# Altium schematic sheet SDRAM_PLEIADES.SchDoc
size Tabloid; DocumentNumber: 1; SheetNumber: 1; SheetTotal: 3; Sheet_Name: PLEIADES MAIN; Size: 11x17
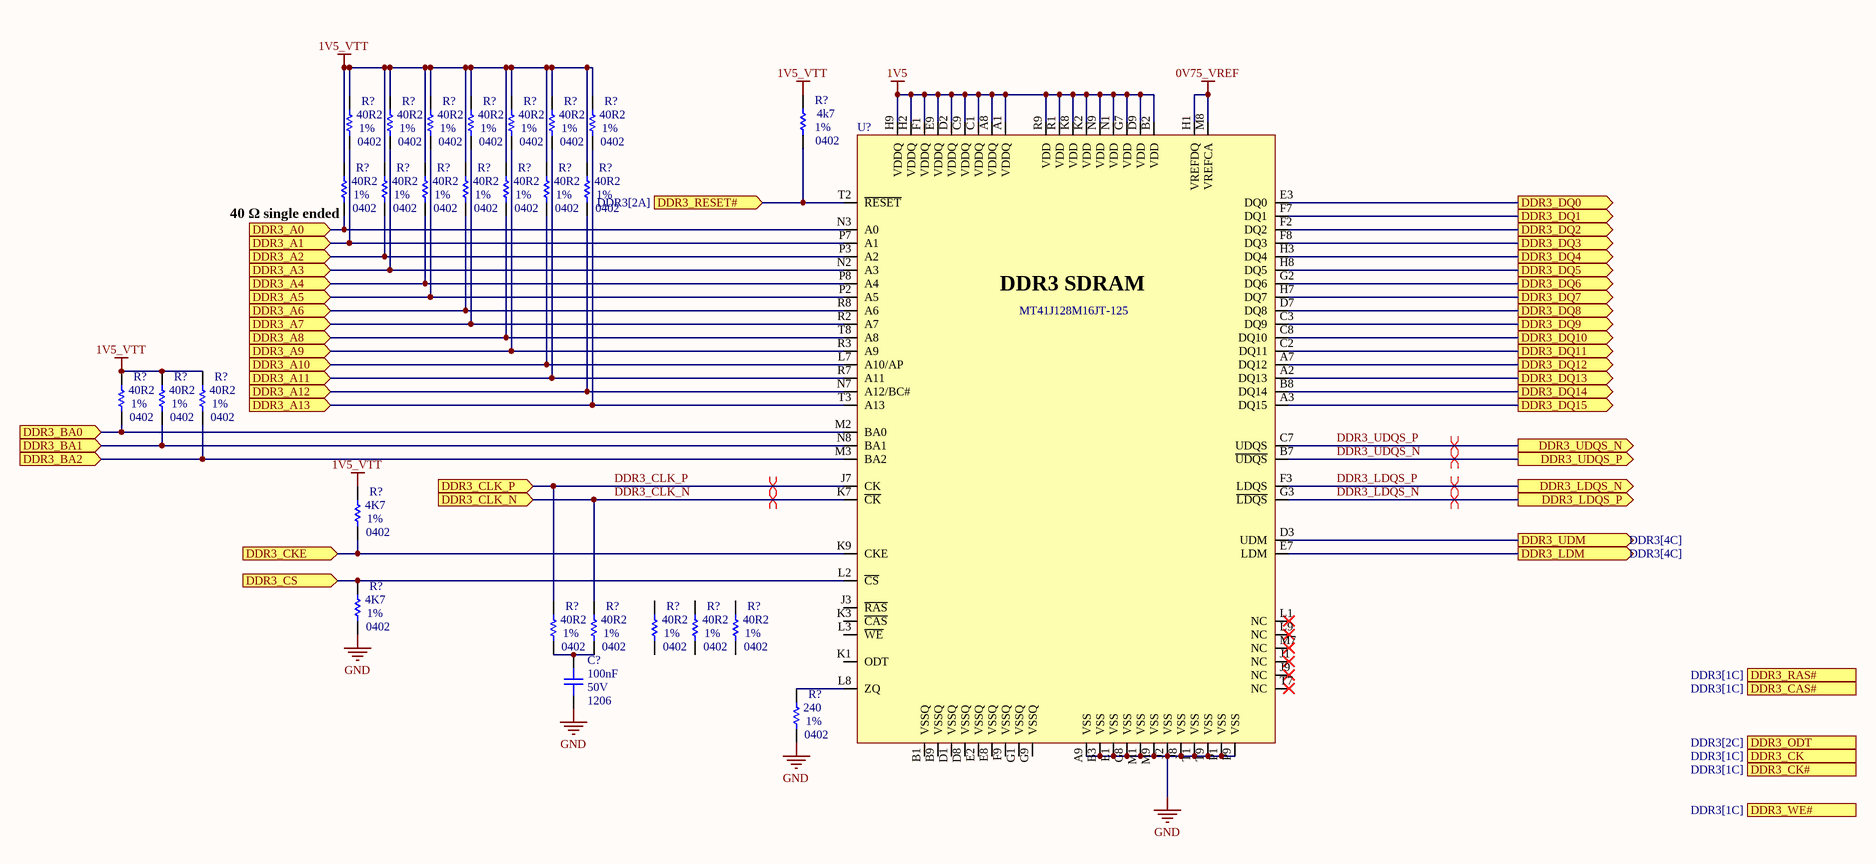
[diagram p0: SDRAM_PLEIADES.SchDoc]

## Parts
(Parts that share a designator on the sheet are numbered #1, #2 ... from top to bottom, then left to right.)
C?  value 100nF  Voltage: 50V  Package: 1206  [CAP_1206]  (hidden comment: CAP - 1206)
R?#1  value 40R2  Package: 0402  Precision: 1%  [RES_0402]  (hidden comment: RES - 0402)
R?#2  value 40R2  Package: 0402  Precision: 1%  [RES_0402]  (hidden comment: RES - 0402)
R?#3  value 40R2  Package: 0402  Precision: 1%  [RES_0402]  (hidden comment: RES - 0402)
R?#4  value 40R2  Package: 0402  Precision: 1%  [RES_0402]  (hidden comment: RES - 0402)
R?#5  value 40R2  Package: 0402  Precision: 1%  [RES_0402]  (hidden comment: RES - 0402)
R?#6  value 40R2  Package: 0402  Precision: 1%  [RES_0402]  (hidden comment: RES - 0402)
R?#7  value 40R2  Package: 0402  Precision: 1%  [RES_0402]  (hidden comment: RES - 0402)
R?#8  value 4k7  Package: 0402  Precision: 1%  [RES_0402]  (hidden comment: RES - 0402)
R?#9  value 40R2  Package: 0402  Precision: 1%  [RES_0402]  (hidden comment: RES - 0402)
R?#10  value 40R2  Package: 0402  Precision: 1%  [RES_0402]  (hidden comment: RES - 0402)
R?#11  value 40R2  Package: 0402  Precision: 1%  [RES_0402]  (hidden comment: RES - 0402)
R?#12  value 40R2  Package: 0402  Precision: 1%  [RES_0402]  (hidden comment: RES - 0402)
R?#13  value 40R2  Package: 0402  Precision: 1%  [RES_0402]  (hidden comment: RES - 0402)
R?#14  value 40R2  Package: 0402  Precision: 1%  [RES_0402]  (hidden comment: RES - 0402)
R?#15  value 40R2  Package: 0402  Precision: 1%  [RES_0402]  (hidden comment: RES - 0402)
R?#16  value 40R2  Package: 0402  Precision: 1%  [RES_0402]  (hidden comment: RES - 0402)
R?#17  value 40R2  Package: 0402  Precision: 1%  [RES_0402]  (hidden comment: RES - 0402)
R?#18  value 40R2  Package: 0402  Precision: 1%  [RES_0402]  (hidden comment: RES - 0402)
R?#19  value 4K7  Package: 0402  Precision: 1%  [RES_0402]  (hidden comment: RES - 0402)
R?#20  value 4K7  Package: 0402  Precision: 1%  [RES_0402]  (hidden comment: RES - 0402)
R?#21  value 40R2  Package: 0402  Precision: 1%  [RES_0402]  (hidden comment: RES - 0402)
R?#22  value 40R2  Package: 0402  Precision: 1%  [RES_0402]  (hidden comment: RES - 0402)
R?#23  value 40R2  Package: 0402  Precision: 1%  [RES_0402]  (hidden comment: RES - 0402)
R?#24  value 40R2  Package: 0402  Precision: 1%  [RES_0402]  (hidden comment: RES - 0402)
R?#25  value 40R2  Package: 0402  Precision: 1%  [RES_0402]  (hidden comment: RES - 0402)
R?#26  value 240  Package: 0402  Precision: 1%  [RES_0402]  (hidden comment: RES - 0402)
U?  MT41J128M16JT-125  [MEM_DDR3_MT41J128M16JT-125]

## Ports
DDR3_A0 (in), DDR3_A1 (in), DDR3_A2 (in), DDR3_A3 (in), DDR3_A4 (in), DDR3_A5 (in), DDR3_A6 (in), DDR3_A7 (in), DDR3_A8 (in), DDR3_A9 (in), DDR3_A10 (in), DDR3_A11 (in), DDR3_A12 (in), DDR3_A13 (in), DDR3_BA0 (in), DDR3_BA1 (in), DDR3_BA2 (in), DDR3_CAS# (out, see DDR3[1C]), DDR3_CK (out, see DDR3[1C]), DDR3_CK# (out, see DDR3[1C]), DDR3_CKE (in), DDR3_CLK_N (in), DDR3_CLK_P (in), DDR3_CS (in), DDR3_DQ0 (out), DDR3_DQ1 (out), DDR3_DQ2 (out), DDR3_DQ3 (out), DDR3_DQ4 (out), DDR3_DQ5 (out), DDR3_DQ6 (out), DDR3_DQ7 (out), DDR3_DQ8 (out), DDR3_DQ9 (out), DDR3_DQ10 (out), DDR3_DQ11 (out), DDR3_DQ12 (out), DDR3_DQ13 (out), DDR3_DQ14 (out), DDR3_DQ15 (out), DDR3_LDM (out, see DDR3[4C]), DDR3_LDQS_N (out), DDR3_LDQS_P (out), DDR3_ODT (out, see DDR3[2C]), DDR3_RAS# (out, see DDR3[1C]), DDR3_RESET# (in, see DDR3[2A]), DDR3_UDM (out, see DDR3[4C]), DDR3_UDQS_N (out), DDR3_UDQS_P (out), DDR3_WE# (out, see DDR3[1C])

## Nets
0V75_VREF: U?.H1(VREFDQ) U?.M8(VREFCA)
1V5: U?.A1(VDDQ) U?.A8(VDDQ) U?.B2(VDD) U?.C1(VDDQ) U?.C9(VDDQ) U?.D2(VDDQ) U?.D9(VDD) U?.E9(VDDQ) U?.F1(VDDQ) U?.G7(VDD) U?.H2(VDDQ) U?.H9(VDDQ) U?.K2(VDD) U?.K8(VDD) U?.N1(VDD) U?.N9(VDD) U?.R1(VDD) U?.R9(VDD)
1V5_VTT: R?#1.2 R?#2.2 R?#3.2 R?#4.2 R?#5.2 R?#6.2 R?#7.2 R?#8.2 R?#9.2 R?#10.2 R?#11.2 R?#12.2 R?#13.2 R?#14.2 R?#15.2 R?#16.2 R?#17.2 R?#18.2 R?#19.2
GND: C?.1 R?#20.1 R?#26.1 U?.A9(VSS) U?.B3(VSS) U?.E1(VSS) U?.G8(VSS) U?.J2(VSS) U?.J8(VSS) U?.M1(VSS) U?.M9(VSS) U?.P1(VSS) U?.P9(VSS) U?.T1(VSS) U?.T9(VSS)
DDR3_A0: R?#9.1 U?.N3(A0) ; port DDR3_A0
DDR3_A1: R?#1.1 U?.P7(A1) ; port DDR3_A1
DDR3_A2: R?#10.1 U?.P3(A2) ; port DDR3_A2
DDR3_A3: R?#2.1 U?.N2(A3) ; port DDR3_A3
DDR3_A4: R?#11.1 U?.P8(A4) ; port DDR3_A4
DDR3_A5: R?#3.1 U?.P2(A5) ; port DDR3_A5
DDR3_A6: R?#12.1 U?.R8(A6) ; port DDR3_A6
DDR3_A7: R?#4.1 U?.R2(A7) ; port DDR3_A7
DDR3_A8: R?#13.1 U?.T8(A8) ; port DDR3_A8
DDR3_A9: R?#5.1 U?.R3(A9) ; port DDR3_A9
DDR3_A10: R?#14.1 U?.L7(A10/AP) ; port DDR3_A10
DDR3_A11: R?#6.1 U?.R7(A11) ; port DDR3_A11
DDR3_A12: R?#15.1 U?.N7(A12/BC#) ; port DDR3_A12
DDR3_A13: R?#7.1 U?.T3(A13) ; port DDR3_A13
DDR3_BA0: R?#16.1 U?.M2(BA0) ; port DDR3_BA0
DDR3_BA1: R?#17.1 U?.N8(BA1) ; port DDR3_BA1
DDR3_BA2: R?#18.1 U?.M3(BA2) ; port DDR3_BA2
DDR3_CKE: R?#19.1 U?.K9(CKE) ; port DDR3_CKE
DDR3_CLK_N: R?#22.2 U?.K7(~{CK}) ; port DDR3_CLK_N
DDR3_CLK_P: R?#21.2 U?.J7(CK) ; port DDR3_CLK_P
DDR3_CS: R?#20.2 U?.L2(~{CS}) ; port DDR3_CS
DDR3_DQ0: U?.E3(DQ0) ; port DDR3_DQ0
DDR3_DQ1: U?.F7(DQ1) ; port DDR3_DQ1
DDR3_DQ2: U?.F2(DQ2) ; port DDR3_DQ2
DDR3_DQ3: U?.F8(DQ3) ; port DDR3_DQ3
DDR3_DQ4: U?.H3(DQ4) ; port DDR3_DQ4
DDR3_DQ5: U?.H8(DQ5) ; port DDR3_DQ5
DDR3_DQ6: U?.G2(DQ6) ; port DDR3_DQ6
DDR3_DQ7: U?.H7(DQ7) ; port DDR3_DQ7
DDR3_DQ8: U?.D7(DQ8) ; port DDR3_DQ8
DDR3_DQ9: U?.C3(DQ9) ; port DDR3_DQ9
DDR3_DQ10: U?.C8(DQ10) ; port DDR3_DQ10
DDR3_DQ11: U?.C2(DQ11) ; port DDR3_DQ11
DDR3_DQ12: U?.A7(DQ12) ; port DDR3_DQ12
DDR3_DQ13: U?.A2(DQ13) ; port DDR3_DQ13
DDR3_DQ14: U?.B8(DQ14) ; port DDR3_DQ14
DDR3_DQ15: U?.A3(DQ15) ; port DDR3_DQ15
DDR3_LDM: U?.E7(LDM) ; port DDR3_LDM
DDR3_LDQS_N: U?.G3(~{LDQS}) ; port DDR3_LDQS_P
DDR3_LDQS_P: U?.F3(LDQS) ; port DDR3_LDQS_N
DDR3_RESET#: R?#8.1 U?.T2(~{RESET}) ; port DDR3_RESET#
DDR3_UDM: U?.D3(UDM) ; port DDR3_UDM
DDR3_UDQS_N: U?.B7(~{UDQS}) ; port DDR3_UDQS_P
DDR3_UDQS_P: U?.C7(UDQS) ; port DDR3_UDQS_N
NetC?_2: C?.2 R?#21.1 R?#22.1
NetR?#26_2: R?#26.2 U?.L8(ZQ)

Not connected (* = marked no-connect by the designer): R?#23 1 2; R?#24 1 2; R?#25 1 2; U? B1(VSSQ) B9(VSSQ) D1(VSSQ) D8(VSSQ) E2(VSSQ) E8(VSSQ) F9(VSSQ) G1(VSSQ) G9(VSSQ) J1(NC)* J3(~{RAS}) J9(NC)* K1(ODT) K3(~{CAS}) L1(NC)* L3(~{WE}) L9(NC)* M7(NC)* T7(NC)*

## Layout directives
differential pair: DDR3_CLK_N, DDR3_CLK_P, DDR3_LDQS_N, DDR3_LDQS_P, DDR3_UDQS_N, DDR3_UDQS_P

## Notes on the sheet
- (near R?#9) 40 Ω single ended
- Sheet Name
- Project Title
- Global Project
- Size
- Group
- Revision
- Date
- Sheet
- of
- Filename
- Designers
- (in symbol MEM_DDR3_MT41J128M16JT-125:K TR) DDR3 SDRAM

## Library data of the parts
C? = CAP - 1206: Precision: 10%; Current: *; CreatedBy: Jonathan Bouchard; Power: *
R?#1-R?#26 = RES - 0402: Voltage: 50V; Power: 1/16W; Current: *; CreatedBy: Jonathan Bouchard
U? = MEM_DDR3_MT41J128M16JT-125:K TR: MEM - DDR3 SDRAM 2GBIT 800MHZ - TFBGA-96; Voltage: 1.425 V ~ 1.575 V; Mfg: Micrel; Current: *; Power: *; Mfg Part Number: MT41J128M16JT-125; HelpURL: http://www.micron.com/~/media/Documents/Products/Data%20Sheet/DRAM/DDR3/2Gb_DDR3_SDRAM.pdf; CreatedBy: Jonathan Bouchard; Temperature: 0°C ~ 95°C (TC); Value: *; Precision: *; Package: TFBGA-96; Supplier 1: Digikey; Supplier Part Number 1: 557-1611-1-ND